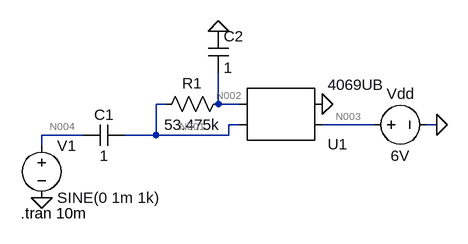
[diagram p0: schematic Q1.asc]
* Q1.asc
* U1: 4069UB (symbol AutoGenerated\4069UB not available, pins judged from their places): pin1=N001 pin2=N002 pin3=N003 pin4=0
Vdd N003 0 6V
V1 N004 0 SINE(0 1m 1k)
C1 N001 N004 1
R1 N002 N001 53.475k
C2 0 N002 1
.tran 10m
.backanno
.end

* Results of the author's LTspice run, read from the files saved beside the schematic
* Operating Point, zero values left out:
*   V(n002) = 2.563 V
*   V(n001) = 2.563 V
*   V(n003) = 6 V
*   I(C2) = -2.563 pA
*   I(C1) = 2.563 pA
*   I(R1) = 2.563 pA
*   I(V1) = 2.563 pA
*   I(Vdd) = -252.3 µA
*   Ix(u1:VO) = -5.125 pA
*   Ix(u1:VDD) = 252.3 µA
*   Ix(u1:VSS) = -252.3 µA
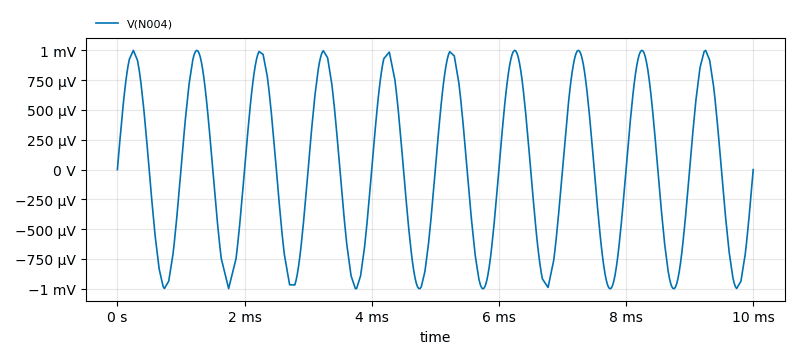
[diagram p1: Transient Analysis of Q1.asc, plotted from the saved traces]
* Transient Analysis, 1 run:
*   V(N004): min -1 mV, max 1 mV, average 1.233 µV, rms 703.9 µV, last 0 V